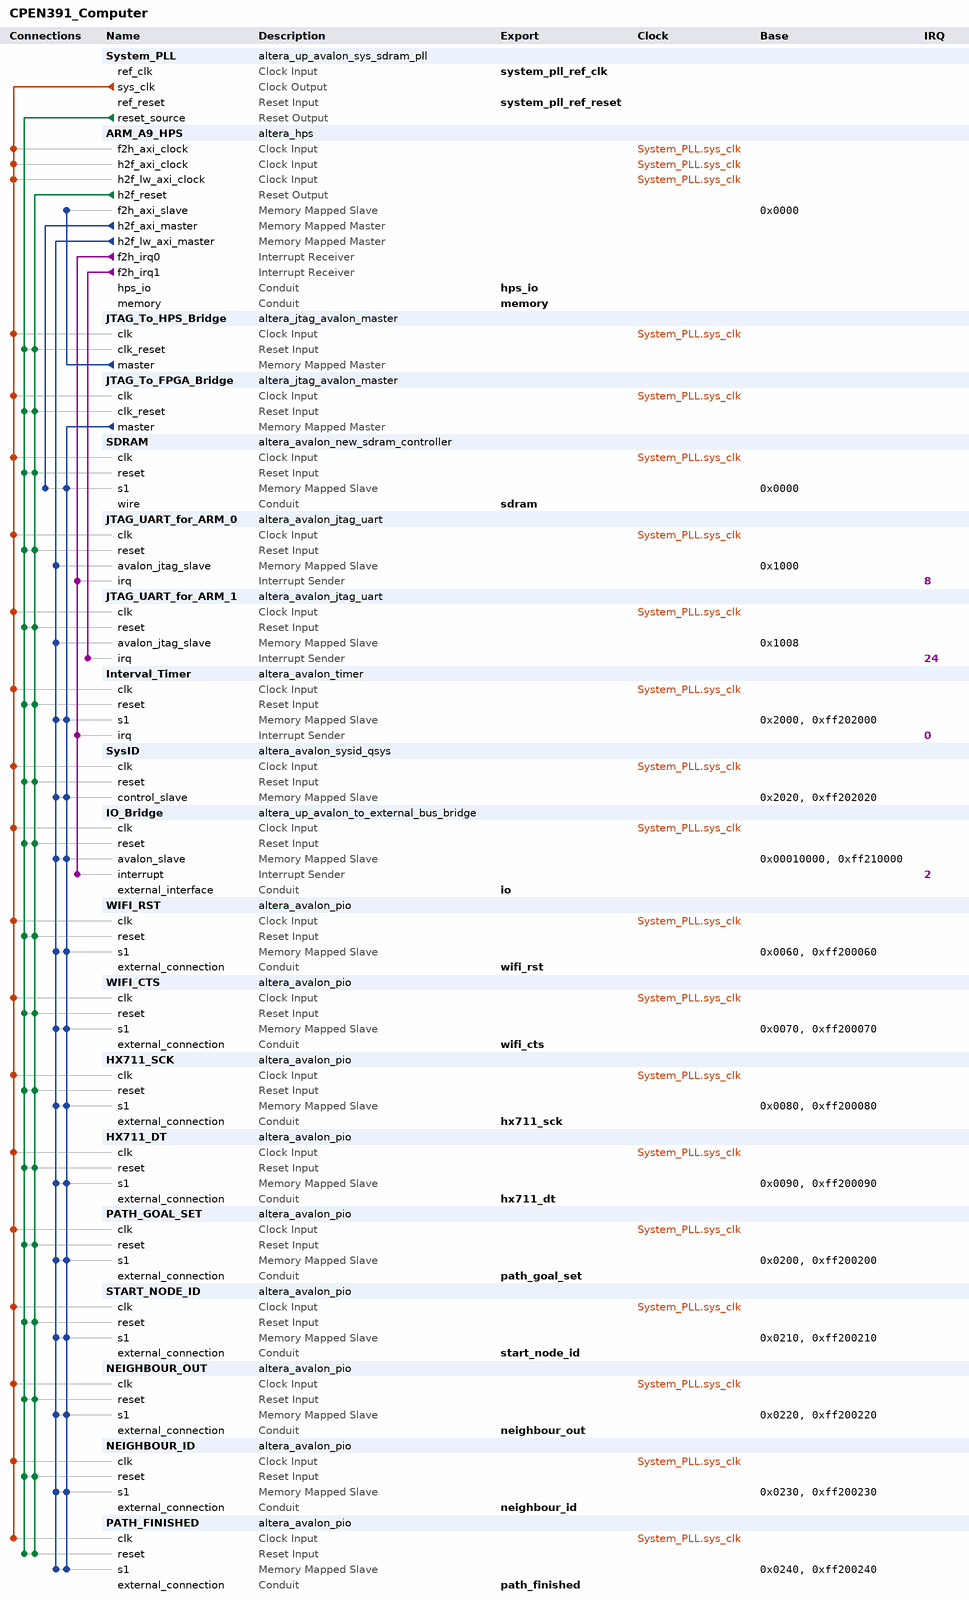
[diagram p0: system contents]
# Platform Designer (Qsys) system CPEN391_Computer, Cyclone V 5CSEMA5F31C6
# Parameters at their usual value, and those the tool derives, are not listed.
package require -exact qsys 15.0
create_system CPEN391_Computer
set_project_property DEVICE_FAMILY {Cyclone V}
set_project_property DEVICE 5CSEMA5F31C6

add_instance System_PLL altera_up_avalon_sys_sdram_pll 15.0
set_instance_parameter_value System_PLL CV_boards DE1-SoC
set_instance_parameter_value System_PLL gui_outclk 50.0
set_instance_parameter_value System_PLL gui_refclk 50.0

add_instance ARM_A9_HPS altera_hps 15.0
set_instance_parameter_value ARM_A9_HPS EMAC1_Mode RGMII
set_instance_parameter_value ARM_A9_HPS EMAC1_PinMuxing {HPS I/O Set 0}
set_instance_parameter_value ARM_A9_HPS F2SCLK_COLDRST_Enable false
set_instance_parameter_value ARM_A9_HPS F2SCLK_DBGRST_Enable false
set_instance_parameter_value ARM_A9_HPS F2SCLK_WARMRST_Enable false
set_instance_parameter_value ARM_A9_HPS F2SINTERRUPT_Enable true
set_instance_parameter_value ARM_A9_HPS F2S_Width 2
set_instance_parameter_value ARM_A9_HPS FPGA_PERIPHERAL_OUTPUT_CLOCK_FREQ_EMAC0_GTX_CLK 100
set_instance_parameter_value ARM_A9_HPS FPGA_PERIPHERAL_OUTPUT_CLOCK_FREQ_EMAC0_MD_CLK 2.5
set_instance_parameter_value ARM_A9_HPS FPGA_PERIPHERAL_OUTPUT_CLOCK_FREQ_EMAC1_GTX_CLK 100
set_instance_parameter_value ARM_A9_HPS FPGA_PERIPHERAL_OUTPUT_CLOCK_FREQ_EMAC1_MD_CLK 2.5
set_instance_parameter_value ARM_A9_HPS HPS_PROTOCOL DDR3
set_instance_parameter_value ARM_A9_HPS I2C0_Mode I2C
set_instance_parameter_value ARM_A9_HPS I2C0_PinMuxing {HPS I/O Set 0}
set_instance_parameter_value ARM_A9_HPS I2C1_Mode I2C
set_instance_parameter_value ARM_A9_HPS I2C1_PinMuxing {HPS I/O Set 0}
set_instance_parameter_value ARM_A9_HPS LWH2F_Enable true
set_instance_parameter_value ARM_A9_HPS MEM_BANKADDR_WIDTH 3
set_instance_parameter_value ARM_A9_HPS MEM_CLK_FREQ 400.0
set_instance_parameter_value ARM_A9_HPS MEM_COL_ADDR_WIDTH 10
set_instance_parameter_value ARM_A9_HPS MEM_DQ_WIDTH 32
set_instance_parameter_value ARM_A9_HPS MEM_DRV_STR RZQ/7
set_instance_parameter_value ARM_A9_HPS MEM_ROW_ADDR_WIDTH 15
set_instance_parameter_value ARM_A9_HPS MEM_RTT_NOM RZQ/4
set_instance_parameter_value ARM_A9_HPS MEM_RTT_WR RZQ/4
set_instance_parameter_value ARM_A9_HPS MEM_TCL 11
set_instance_parameter_value ARM_A9_HPS MEM_TFAW_NS 30.0
set_instance_parameter_value ARM_A9_HPS MEM_TRAS_NS 35.0
set_instance_parameter_value ARM_A9_HPS MEM_TRCD_NS 13.75
set_instance_parameter_value ARM_A9_HPS MEM_TRFC_NS 260.0
set_instance_parameter_value ARM_A9_HPS MEM_TRP_NS 13.75
set_instance_parameter_value ARM_A9_HPS MEM_VENDOR JEDEC
set_instance_parameter_value ARM_A9_HPS MEM_WTCL 8
set_instance_parameter_value ARM_A9_HPS QSPI_Mode {1 SS}
set_instance_parameter_value ARM_A9_HPS QSPI_PinMuxing {HPS I/O Set 0}
set_instance_parameter_value ARM_A9_HPS REF_CLK_FREQ 25.0
set_instance_parameter_value ARM_A9_HPS S2F_Width 2
set_instance_parameter_value ARM_A9_HPS SDIO_Mode {4-bit Data}
set_instance_parameter_value ARM_A9_HPS SDIO_PinMuxing {HPS I/O Set 0}
set_instance_parameter_value ARM_A9_HPS SPIM1_Mode {Single Slave Select}
set_instance_parameter_value ARM_A9_HPS SPIM1_PinMuxing {HPS I/O Set 0}
set_instance_parameter_value ARM_A9_HPS STM_Enable false
set_instance_parameter_value ARM_A9_HPS TIMING_BOARD_AC_SKEW 0.03
set_instance_parameter_value ARM_A9_HPS TIMING_BOARD_AC_TO_CK_SKEW 0.0
set_instance_parameter_value ARM_A9_HPS TIMING_BOARD_DQ_TO_DQS_SKEW 0.0
set_instance_parameter_value ARM_A9_HPS TIMING_BOARD_MAX_CK_DELAY 0.03
set_instance_parameter_value ARM_A9_HPS TIMING_BOARD_MAX_DQS_DELAY 0.02
set_instance_parameter_value ARM_A9_HPS TIMING_BOARD_SKEW_BETWEEN_DQS 0.08
set_instance_parameter_value ARM_A9_HPS TIMING_BOARD_SKEW_CKDQS_DIMM_MAX 0.16
set_instance_parameter_value ARM_A9_HPS TIMING_BOARD_SKEW_CKDQS_DIMM_MIN 0.09
set_instance_parameter_value ARM_A9_HPS TIMING_BOARD_SKEW_WITHIN_DQS 0.01
set_instance_parameter_value ARM_A9_HPS TIMING_TDH 65
set_instance_parameter_value ARM_A9_HPS TIMING_TDQSCK 225
set_instance_parameter_value ARM_A9_HPS TIMING_TDQSQ 125
set_instance_parameter_value ARM_A9_HPS TIMING_TDS 30
set_instance_parameter_value ARM_A9_HPS TIMING_TIH 140
set_instance_parameter_value ARM_A9_HPS TIMING_TIS 180
set_instance_parameter_value ARM_A9_HPS TIMING_TQSH 0.4
set_instance_parameter_value ARM_A9_HPS UART0_Mode {No Flow Control}
set_instance_parameter_value ARM_A9_HPS UART0_PinMuxing {HPS I/O Set 0}
set_instance_parameter_value ARM_A9_HPS USB1_Mode SDR
set_instance_parameter_value ARM_A9_HPS USB1_PinMuxing {HPS I/O Set 0}
set_instance_parameter_value ARM_A9_HPS desired_cfg_clk_mhz 100.0
set_instance_parameter_value ARM_A9_HPS desired_qspi_clk_mhz 400.0

add_instance JTAG_To_HPS_Bridge altera_jtag_avalon_master 15.0

add_instance JTAG_To_FPGA_Bridge altera_jtag_avalon_master 15.0

add_instance SDRAM altera_avalon_new_sdram_controller 15.0
set_instance_parameter_value SDRAM TAC 5.5
set_instance_parameter_value SDRAM TRCD 20.0
set_instance_parameter_value SDRAM TRP 20.0
set_instance_parameter_value SDRAM casLatency 3
set_instance_parameter_value SDRAM columnWidth 10
set_instance_parameter_value SDRAM dataWidth 16
set_instance_parameter_value SDRAM generateSimulationModel true
set_instance_parameter_value SDRAM model single_Micron_MT48LC4M32B2_7_chip
set_instance_parameter_value SDRAM numberOfBanks 4
set_instance_parameter_value SDRAM numberOfChipSelects 1
set_instance_parameter_value SDRAM powerUpDelay 100.0
set_instance_parameter_value SDRAM refreshPeriod 15.625
set_instance_parameter_value SDRAM rowWidth 13

add_instance JTAG_UART_for_ARM_0 altera_avalon_jtag_uart 15.0
set_instance_parameter_value JTAG_UART_for_ARM_0 simInteractiveOptions NO_INTERACTIVE_WINDOWS

add_instance JTAG_UART_for_ARM_1 altera_avalon_jtag_uart 15.0
set_instance_parameter_value JTAG_UART_for_ARM_1 simInteractiveOptions NO_INTERACTIVE_WINDOWS

add_instance Interval_Timer altera_avalon_timer 15.0
set_instance_parameter_value Interval_Timer period 125
set_instance_parameter_value Interval_Timer periodUnits MSEC

add_instance SysID altera_avalon_sysid_qsys 15.0
set_instance_parameter_value SysID id 0

add_instance IO_Bridge altera_up_avalon_to_external_bus_bridge 15.0
set_instance_parameter_value IO_Bridge addr_size 64
set_instance_parameter_value IO_Bridge addr_size_multiplier Kbytes
set_instance_parameter_value IO_Bridge data_size 16

add_instance WIFI_RST altera_avalon_pio 15.0
set_instance_parameter_value WIFI_RST direction Output
set_instance_parameter_value WIFI_RST width 1

add_instance WIFI_CTS altera_avalon_pio 15.0
set_instance_parameter_value WIFI_CTS direction Output
set_instance_parameter_value WIFI_CTS width 1

add_instance HX711_SCK altera_avalon_pio 15.0
set_instance_parameter_value HX711_SCK direction Output
set_instance_parameter_value HX711_SCK width 1

add_instance HX711_DT altera_avalon_pio 15.0
set_instance_parameter_value HX711_DT direction Input
set_instance_parameter_value HX711_DT width 1

add_instance PATH_GOAL_SET altera_avalon_pio 15.0
set_instance_parameter_value PATH_GOAL_SET direction Output
set_instance_parameter_value PATH_GOAL_SET width 1

add_instance START_NODE_ID altera_avalon_pio 15.0
set_instance_parameter_value START_NODE_ID direction Output
set_instance_parameter_value START_NODE_ID width 9

add_instance NEIGHBOUR_OUT altera_avalon_pio 15.0
set_instance_parameter_value NEIGHBOUR_OUT direction Input
set_instance_parameter_value NEIGHBOUR_OUT width 9

add_instance NEIGHBOUR_ID altera_avalon_pio 15.0
set_instance_parameter_value NEIGHBOUR_ID direction Output
set_instance_parameter_value NEIGHBOUR_ID width 9

add_instance PATH_FINISHED altera_avalon_pio 15.0
set_instance_parameter_value PATH_FINISHED direction Input
set_instance_parameter_value PATH_FINISHED width 1

# connections
add_connection System_PLL.sys_clk ARM_A9_HPS.f2h_axi_clock clock
add_connection System_PLL.sys_clk ARM_A9_HPS.h2f_axi_clock clock
add_connection System_PLL.sys_clk ARM_A9_HPS.h2f_lw_axi_clock clock
add_connection System_PLL.sys_clk HX711_DT.clk clock
add_connection System_PLL.sys_clk HX711_SCK.clk clock
add_connection System_PLL.sys_clk Interval_Timer.clk clock
add_connection System_PLL.sys_clk IO_Bridge.clk clock
add_connection System_PLL.sys_clk JTAG_To_FPGA_Bridge.clk clock
add_connection System_PLL.sys_clk JTAG_To_HPS_Bridge.clk clock
add_connection System_PLL.sys_clk JTAG_UART_for_ARM_0.clk clock
add_connection System_PLL.sys_clk JTAG_UART_for_ARM_1.clk clock
add_connection System_PLL.sys_clk NEIGHBOUR_ID.clk clock
add_connection System_PLL.sys_clk NEIGHBOUR_OUT.clk clock
add_connection System_PLL.sys_clk PATH_FINISHED.clk clock
add_connection System_PLL.sys_clk PATH_GOAL_SET.clk clock
add_connection System_PLL.sys_clk SDRAM.clk clock
add_connection System_PLL.sys_clk START_NODE_ID.clk clock
add_connection System_PLL.sys_clk SysID.clk clock
add_connection System_PLL.sys_clk WIFI_CTS.clk clock
add_connection System_PLL.sys_clk WIFI_RST.clk clock
add_connection ARM_A9_HPS.h2f_reset HX711_DT.reset reset
add_connection ARM_A9_HPS.h2f_reset HX711_SCK.reset reset
add_connection ARM_A9_HPS.h2f_reset Interval_Timer.reset reset
add_connection ARM_A9_HPS.h2f_reset IO_Bridge.reset reset
add_connection ARM_A9_HPS.h2f_reset JTAG_To_FPGA_Bridge.clk_reset reset
add_connection ARM_A9_HPS.h2f_reset JTAG_To_HPS_Bridge.clk_reset reset
add_connection ARM_A9_HPS.h2f_reset JTAG_UART_for_ARM_0.reset reset
add_connection ARM_A9_HPS.h2f_reset JTAG_UART_for_ARM_1.reset reset
add_connection ARM_A9_HPS.h2f_reset NEIGHBOUR_ID.reset reset
add_connection ARM_A9_HPS.h2f_reset NEIGHBOUR_OUT.reset reset
add_connection ARM_A9_HPS.h2f_reset PATH_FINISHED.reset reset
add_connection ARM_A9_HPS.h2f_reset PATH_GOAL_SET.reset reset
add_connection ARM_A9_HPS.h2f_reset SDRAM.reset reset
add_connection ARM_A9_HPS.h2f_reset START_NODE_ID.reset reset
add_connection ARM_A9_HPS.h2f_reset SysID.reset reset
add_connection ARM_A9_HPS.h2f_reset WIFI_CTS.reset reset
add_connection ARM_A9_HPS.h2f_reset WIFI_RST.reset reset
add_connection System_PLL.reset_source HX711_DT.reset reset
add_connection System_PLL.reset_source HX711_SCK.reset reset
add_connection System_PLL.reset_source Interval_Timer.reset reset
add_connection System_PLL.reset_source IO_Bridge.reset reset
add_connection System_PLL.reset_source JTAG_To_FPGA_Bridge.clk_reset reset
add_connection System_PLL.reset_source JTAG_To_HPS_Bridge.clk_reset reset
add_connection System_PLL.reset_source JTAG_UART_for_ARM_0.reset reset
add_connection System_PLL.reset_source JTAG_UART_for_ARM_1.reset reset
add_connection System_PLL.reset_source NEIGHBOUR_ID.reset reset
add_connection System_PLL.reset_source NEIGHBOUR_OUT.reset reset
add_connection System_PLL.reset_source PATH_FINISHED.reset reset
add_connection System_PLL.reset_source PATH_GOAL_SET.reset reset
add_connection System_PLL.reset_source SDRAM.reset reset
add_connection System_PLL.reset_source START_NODE_ID.reset reset
add_connection System_PLL.reset_source SysID.reset reset
add_connection System_PLL.reset_source WIFI_CTS.reset reset
add_connection System_PLL.reset_source WIFI_RST.reset reset
add_connection ARM_A9_HPS.h2f_axi_master SDRAM.s1 avalon
set_connection_parameter_value ARM_A9_HPS.h2f_axi_master/SDRAM.s1 baseAddress 0x0000
add_connection ARM_A9_HPS.h2f_lw_axi_master HX711_DT.s1 avalon
set_connection_parameter_value ARM_A9_HPS.h2f_lw_axi_master/HX711_DT.s1 baseAddress 0x0090
add_connection ARM_A9_HPS.h2f_lw_axi_master HX711_SCK.s1 avalon
set_connection_parameter_value ARM_A9_HPS.h2f_lw_axi_master/HX711_SCK.s1 baseAddress 0x0080
add_connection ARM_A9_HPS.h2f_lw_axi_master Interval_Timer.s1 avalon
set_connection_parameter_value ARM_A9_HPS.h2f_lw_axi_master/Interval_Timer.s1 baseAddress 0x2000
add_connection ARM_A9_HPS.h2f_lw_axi_master IO_Bridge.avalon_slave avalon
set_connection_parameter_value ARM_A9_HPS.h2f_lw_axi_master/IO_Bridge.avalon_slave baseAddress 0x00010000
add_connection ARM_A9_HPS.h2f_lw_axi_master JTAG_UART_for_ARM_0.avalon_jtag_slave avalon
set_connection_parameter_value ARM_A9_HPS.h2f_lw_axi_master/JTAG_UART_for_ARM_0.avalon_jtag_slave baseAddress 0x1000
add_connection ARM_A9_HPS.h2f_lw_axi_master JTAG_UART_for_ARM_1.avalon_jtag_slave avalon
set_connection_parameter_value ARM_A9_HPS.h2f_lw_axi_master/JTAG_UART_for_ARM_1.avalon_jtag_slave baseAddress 0x1008
add_connection ARM_A9_HPS.h2f_lw_axi_master NEIGHBOUR_ID.s1 avalon
set_connection_parameter_value ARM_A9_HPS.h2f_lw_axi_master/NEIGHBOUR_ID.s1 baseAddress 0x0230
add_connection ARM_A9_HPS.h2f_lw_axi_master NEIGHBOUR_OUT.s1 avalon
set_connection_parameter_value ARM_A9_HPS.h2f_lw_axi_master/NEIGHBOUR_OUT.s1 baseAddress 0x0220
add_connection ARM_A9_HPS.h2f_lw_axi_master PATH_FINISHED.s1 avalon
set_connection_parameter_value ARM_A9_HPS.h2f_lw_axi_master/PATH_FINISHED.s1 baseAddress 0x0240
add_connection ARM_A9_HPS.h2f_lw_axi_master PATH_GOAL_SET.s1 avalon
set_connection_parameter_value ARM_A9_HPS.h2f_lw_axi_master/PATH_GOAL_SET.s1 baseAddress 0x0200
add_connection ARM_A9_HPS.h2f_lw_axi_master START_NODE_ID.s1 avalon
set_connection_parameter_value ARM_A9_HPS.h2f_lw_axi_master/START_NODE_ID.s1 baseAddress 0x0210
add_connection ARM_A9_HPS.h2f_lw_axi_master SysID.control_slave avalon
set_connection_parameter_value ARM_A9_HPS.h2f_lw_axi_master/SysID.control_slave baseAddress 0x2020
add_connection ARM_A9_HPS.h2f_lw_axi_master WIFI_CTS.s1 avalon
set_connection_parameter_value ARM_A9_HPS.h2f_lw_axi_master/WIFI_CTS.s1 baseAddress 0x0070
add_connection ARM_A9_HPS.h2f_lw_axi_master WIFI_RST.s1 avalon
set_connection_parameter_value ARM_A9_HPS.h2f_lw_axi_master/WIFI_RST.s1 baseAddress 0x0060
add_connection JTAG_To_FPGA_Bridge.master HX711_DT.s1 avalon
set_connection_parameter_value JTAG_To_FPGA_Bridge.master/HX711_DT.s1 baseAddress 0xff200090
add_connection JTAG_To_FPGA_Bridge.master HX711_SCK.s1 avalon
set_connection_parameter_value JTAG_To_FPGA_Bridge.master/HX711_SCK.s1 baseAddress 0xff200080
add_connection JTAG_To_FPGA_Bridge.master Interval_Timer.s1 avalon
set_connection_parameter_value JTAG_To_FPGA_Bridge.master/Interval_Timer.s1 baseAddress 0xff202000
add_connection JTAG_To_FPGA_Bridge.master IO_Bridge.avalon_slave avalon
set_connection_parameter_value JTAG_To_FPGA_Bridge.master/IO_Bridge.avalon_slave baseAddress 0xff210000
add_connection JTAG_To_FPGA_Bridge.master NEIGHBOUR_ID.s1 avalon
set_connection_parameter_value JTAG_To_FPGA_Bridge.master/NEIGHBOUR_ID.s1 baseAddress 0xff200230
add_connection JTAG_To_FPGA_Bridge.master NEIGHBOUR_OUT.s1 avalon
set_connection_parameter_value JTAG_To_FPGA_Bridge.master/NEIGHBOUR_OUT.s1 baseAddress 0xff200220
add_connection JTAG_To_FPGA_Bridge.master PATH_FINISHED.s1 avalon
set_connection_parameter_value JTAG_To_FPGA_Bridge.master/PATH_FINISHED.s1 baseAddress 0xff200240
add_connection JTAG_To_FPGA_Bridge.master PATH_GOAL_SET.s1 avalon
set_connection_parameter_value JTAG_To_FPGA_Bridge.master/PATH_GOAL_SET.s1 baseAddress 0xff200200
add_connection JTAG_To_FPGA_Bridge.master SDRAM.s1 avalon
set_connection_parameter_value JTAG_To_FPGA_Bridge.master/SDRAM.s1 baseAddress 0x0000
add_connection JTAG_To_FPGA_Bridge.master START_NODE_ID.s1 avalon
set_connection_parameter_value JTAG_To_FPGA_Bridge.master/START_NODE_ID.s1 baseAddress 0xff200210
add_connection JTAG_To_FPGA_Bridge.master SysID.control_slave avalon
set_connection_parameter_value JTAG_To_FPGA_Bridge.master/SysID.control_slave baseAddress 0xff202020
add_connection JTAG_To_FPGA_Bridge.master WIFI_CTS.s1 avalon
set_connection_parameter_value JTAG_To_FPGA_Bridge.master/WIFI_CTS.s1 baseAddress 0xff200070
add_connection JTAG_To_FPGA_Bridge.master WIFI_RST.s1 avalon
set_connection_parameter_value JTAG_To_FPGA_Bridge.master/WIFI_RST.s1 baseAddress 0xff200060
add_connection JTAG_To_HPS_Bridge.master ARM_A9_HPS.f2h_axi_slave avalon
set_connection_parameter_value JTAG_To_HPS_Bridge.master/ARM_A9_HPS.f2h_axi_slave baseAddress 0x0000
add_connection ARM_A9_HPS.f2h_irq0 Interval_Timer.irq interrupt
set_connection_parameter_value ARM_A9_HPS.f2h_irq0/Interval_Timer.irq irqNumber 0
add_connection ARM_A9_HPS.f2h_irq0 IO_Bridge.interrupt interrupt
set_connection_parameter_value ARM_A9_HPS.f2h_irq0/IO_Bridge.interrupt irqNumber 2
add_connection ARM_A9_HPS.f2h_irq0 JTAG_UART_for_ARM_0.irq interrupt
set_connection_parameter_value ARM_A9_HPS.f2h_irq0/JTAG_UART_for_ARM_0.irq irqNumber 8
add_connection ARM_A9_HPS.f2h_irq1 JTAG_UART_for_ARM_1.irq interrupt
set_connection_parameter_value ARM_A9_HPS.f2h_irq1/JTAG_UART_for_ARM_1.irq irqNumber 24

# exported interfaces
add_interface hps_io conduit end
set_interface_property hps_io EXPORT_OF ARM_A9_HPS.hps_io
add_interface hx711_dt conduit end
set_interface_property hx711_dt EXPORT_OF HX711_DT.external_connection
add_interface hx711_sck conduit end
set_interface_property hx711_sck EXPORT_OF HX711_SCK.external_connection
add_interface io conduit end
set_interface_property io EXPORT_OF IO_Bridge.external_interface
add_interface memory conduit end
set_interface_property memory EXPORT_OF ARM_A9_HPS.memory
add_interface neighbour_id conduit end
set_interface_property neighbour_id EXPORT_OF NEIGHBOUR_ID.external_connection
add_interface neighbour_out conduit end
set_interface_property neighbour_out EXPORT_OF NEIGHBOUR_OUT.external_connection
add_interface path_finished conduit end
set_interface_property path_finished EXPORT_OF PATH_FINISHED.external_connection
add_interface path_goal_set conduit end
set_interface_property path_goal_set EXPORT_OF PATH_GOAL_SET.external_connection
add_interface sdram conduit end
set_interface_property sdram EXPORT_OF SDRAM.wire
add_interface start_node_id conduit end
set_interface_property start_node_id EXPORT_OF START_NODE_ID.external_connection
add_interface system_pll_ref_clk clock sink
set_interface_property system_pll_ref_clk EXPORT_OF System_PLL.ref_clk
add_interface system_pll_ref_reset reset sink
set_interface_property system_pll_ref_reset EXPORT_OF System_PLL.ref_reset
add_interface wifi_cts conduit end
set_interface_property wifi_cts EXPORT_OF WIFI_CTS.external_connection
add_interface wifi_rst conduit end
set_interface_property wifi_rst EXPORT_OF WIFI_RST.external_connection

set_interconnect_requirement {$system} qsys_mm.clockCrossingAdapter HANDSHAKE
set_interconnect_requirement {$system} qsys_mm.enableEccProtection FALSE
set_interconnect_requirement {$system} qsys_mm.insertDefaultSlave FALSE
set_interconnect_requirement {$system} qsys_mm.maxAdditionalLatency 1

save_system CPEN391_Computer.qsys
